# EAGLE design SOT23-6 (EAGLE 5.11)
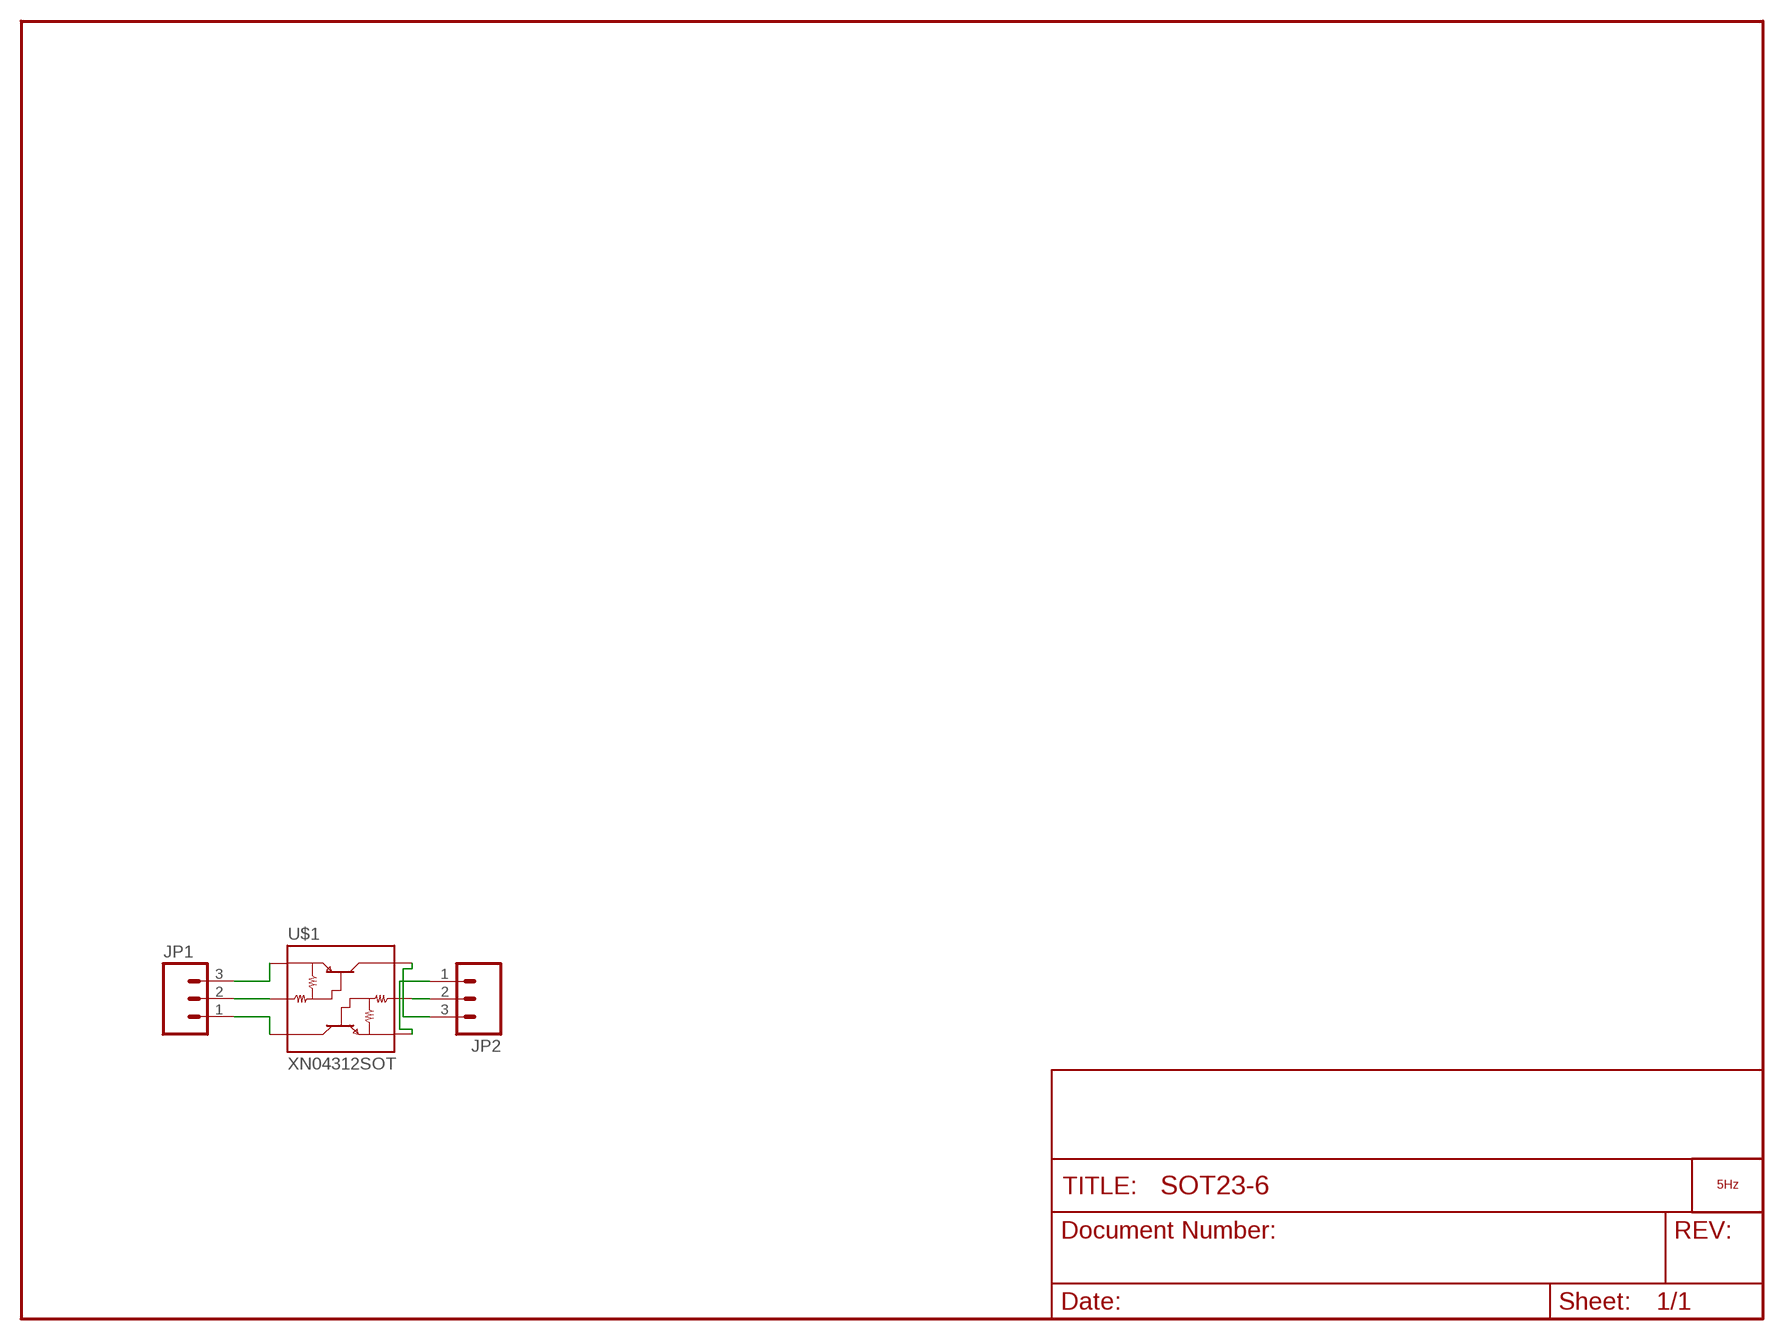
[diagram p0: schematic, sheet 1]

## Parts
JP1  M03PTH  [1X03]
JP2  M03PTH  [1X03]
LOGO1  LOGO_5HZ_CIRC_COOPER_5MM  [5HZ_LOGO_CIRC_COOPER_5MM]
U$1  XN04312SOT  [SOT23-6]

## Nets
N$1: JP1.3 U$1.3(E2)
N$2: JP1.2 U$1.2(B2)
N$3: JP1.1 U$1.1(C1)
N$4: JP2.2 U$1.5(B1)
N$5: JP2.1 U$1.6(E1)
N$6: JP2.3 U$1.4(C2)

## Library data of the parts
JP1 JP2 = SparkFun:M03: Header 3 Standard 3-pin 0.1" header. Use with straight break away headers (SKU : PRT-00116), right angle break away headers (PRT-00553), swiss pins (PRT-00743), machine pins (PRT-00117), and female headers (PRT-00115). Molex polarized connector foot print use with SKU : PRT-08232 with associated crimp pins and housings.
LOGO1 = 5hz-electronica:LOGO_5HZ: Logotipo 5Hz "según Pedro"
U$1 = SparkFun:XN04312: NPN/PNP Transistor Array Handy dandy transistor array for level shifting and inverting signals. Spark Fun Electronics SKU : COM-00588

## Board
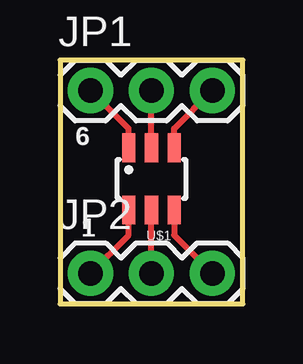
[diagram p1: board, top side]
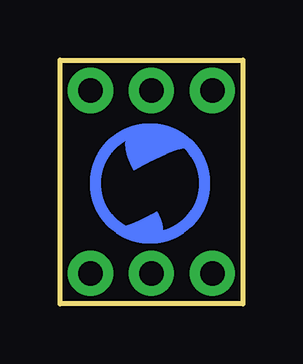
[diagram p2: board, bottom side, seen from below]

Size 7.62 x 10.16 mm. Coordinates in mm from the lower left corner, seen from the top.
Outline: 0,0 7.62,0 7.62,10.16 0,10.16 0,0
Copper layers (1*16): Top 0.035mm / dielectric 1.5mm / Bottom 0.035mm
Design rules: minimum track width 10mil, minimum drill 24mil, track to track 8mil, track to pad 8mil, pad to pad 8mil, via to via 8mil, smd to smd 8mil, copper to edge 40mil, drill to drill 8mil, minimum pad ring 10mil, minimum via ring 8mil, stop-mask expansion 4mil, vias tented up to drill 0mil, thermal gap 10mil

### Footprints (pad centres in the part's own frame; a part is rotated, then mirrored left to right if it is on the bottom)
1X03 = drill 1.016 pad 1.88: 1 0,0; 2 2.54,0; 3 5.08,0
SOT23-6 = smd 0.55 x 1.2: 1 0.95,-1.3; 2 0,-1.3; 3 -0.95,-1.3; 4 -0.95,1.3; 5 0,1.3; 6 0.95,1.3

### Placement (x,y rotation side)
JP1  1.27,8.89 0 top
JP2  1.27,1.27 0 top
LOGO1  6.35,2.54 0 bottom
U$1  3.81,5.21 180 top

### Tracks (layer width: path | path; a pad name or v marks a point on that pad's centre or on a via)
N$1
  Top 0.254: U$1.3 4.76,7.3 JP1.3
N$2
  Top 0.254: U$1.2 JP1.2
N$3
  Top 0.254: U$1.1 2.86,7.3 JP1.1
N$4
  Top 0.254: JP2.2 U$1.5
N$5
  Top 0.254: U$1.6 2.86,2.86 JP2.1
N$6
  Top 0.254: U$1.4 4.76,2.86 JP2.3

### Text on the board
tPlace: 6 | 1